# EasyEDA schematic SCH_MinijetengineECU_20260723.json

## Sheets
1 ECU_JET
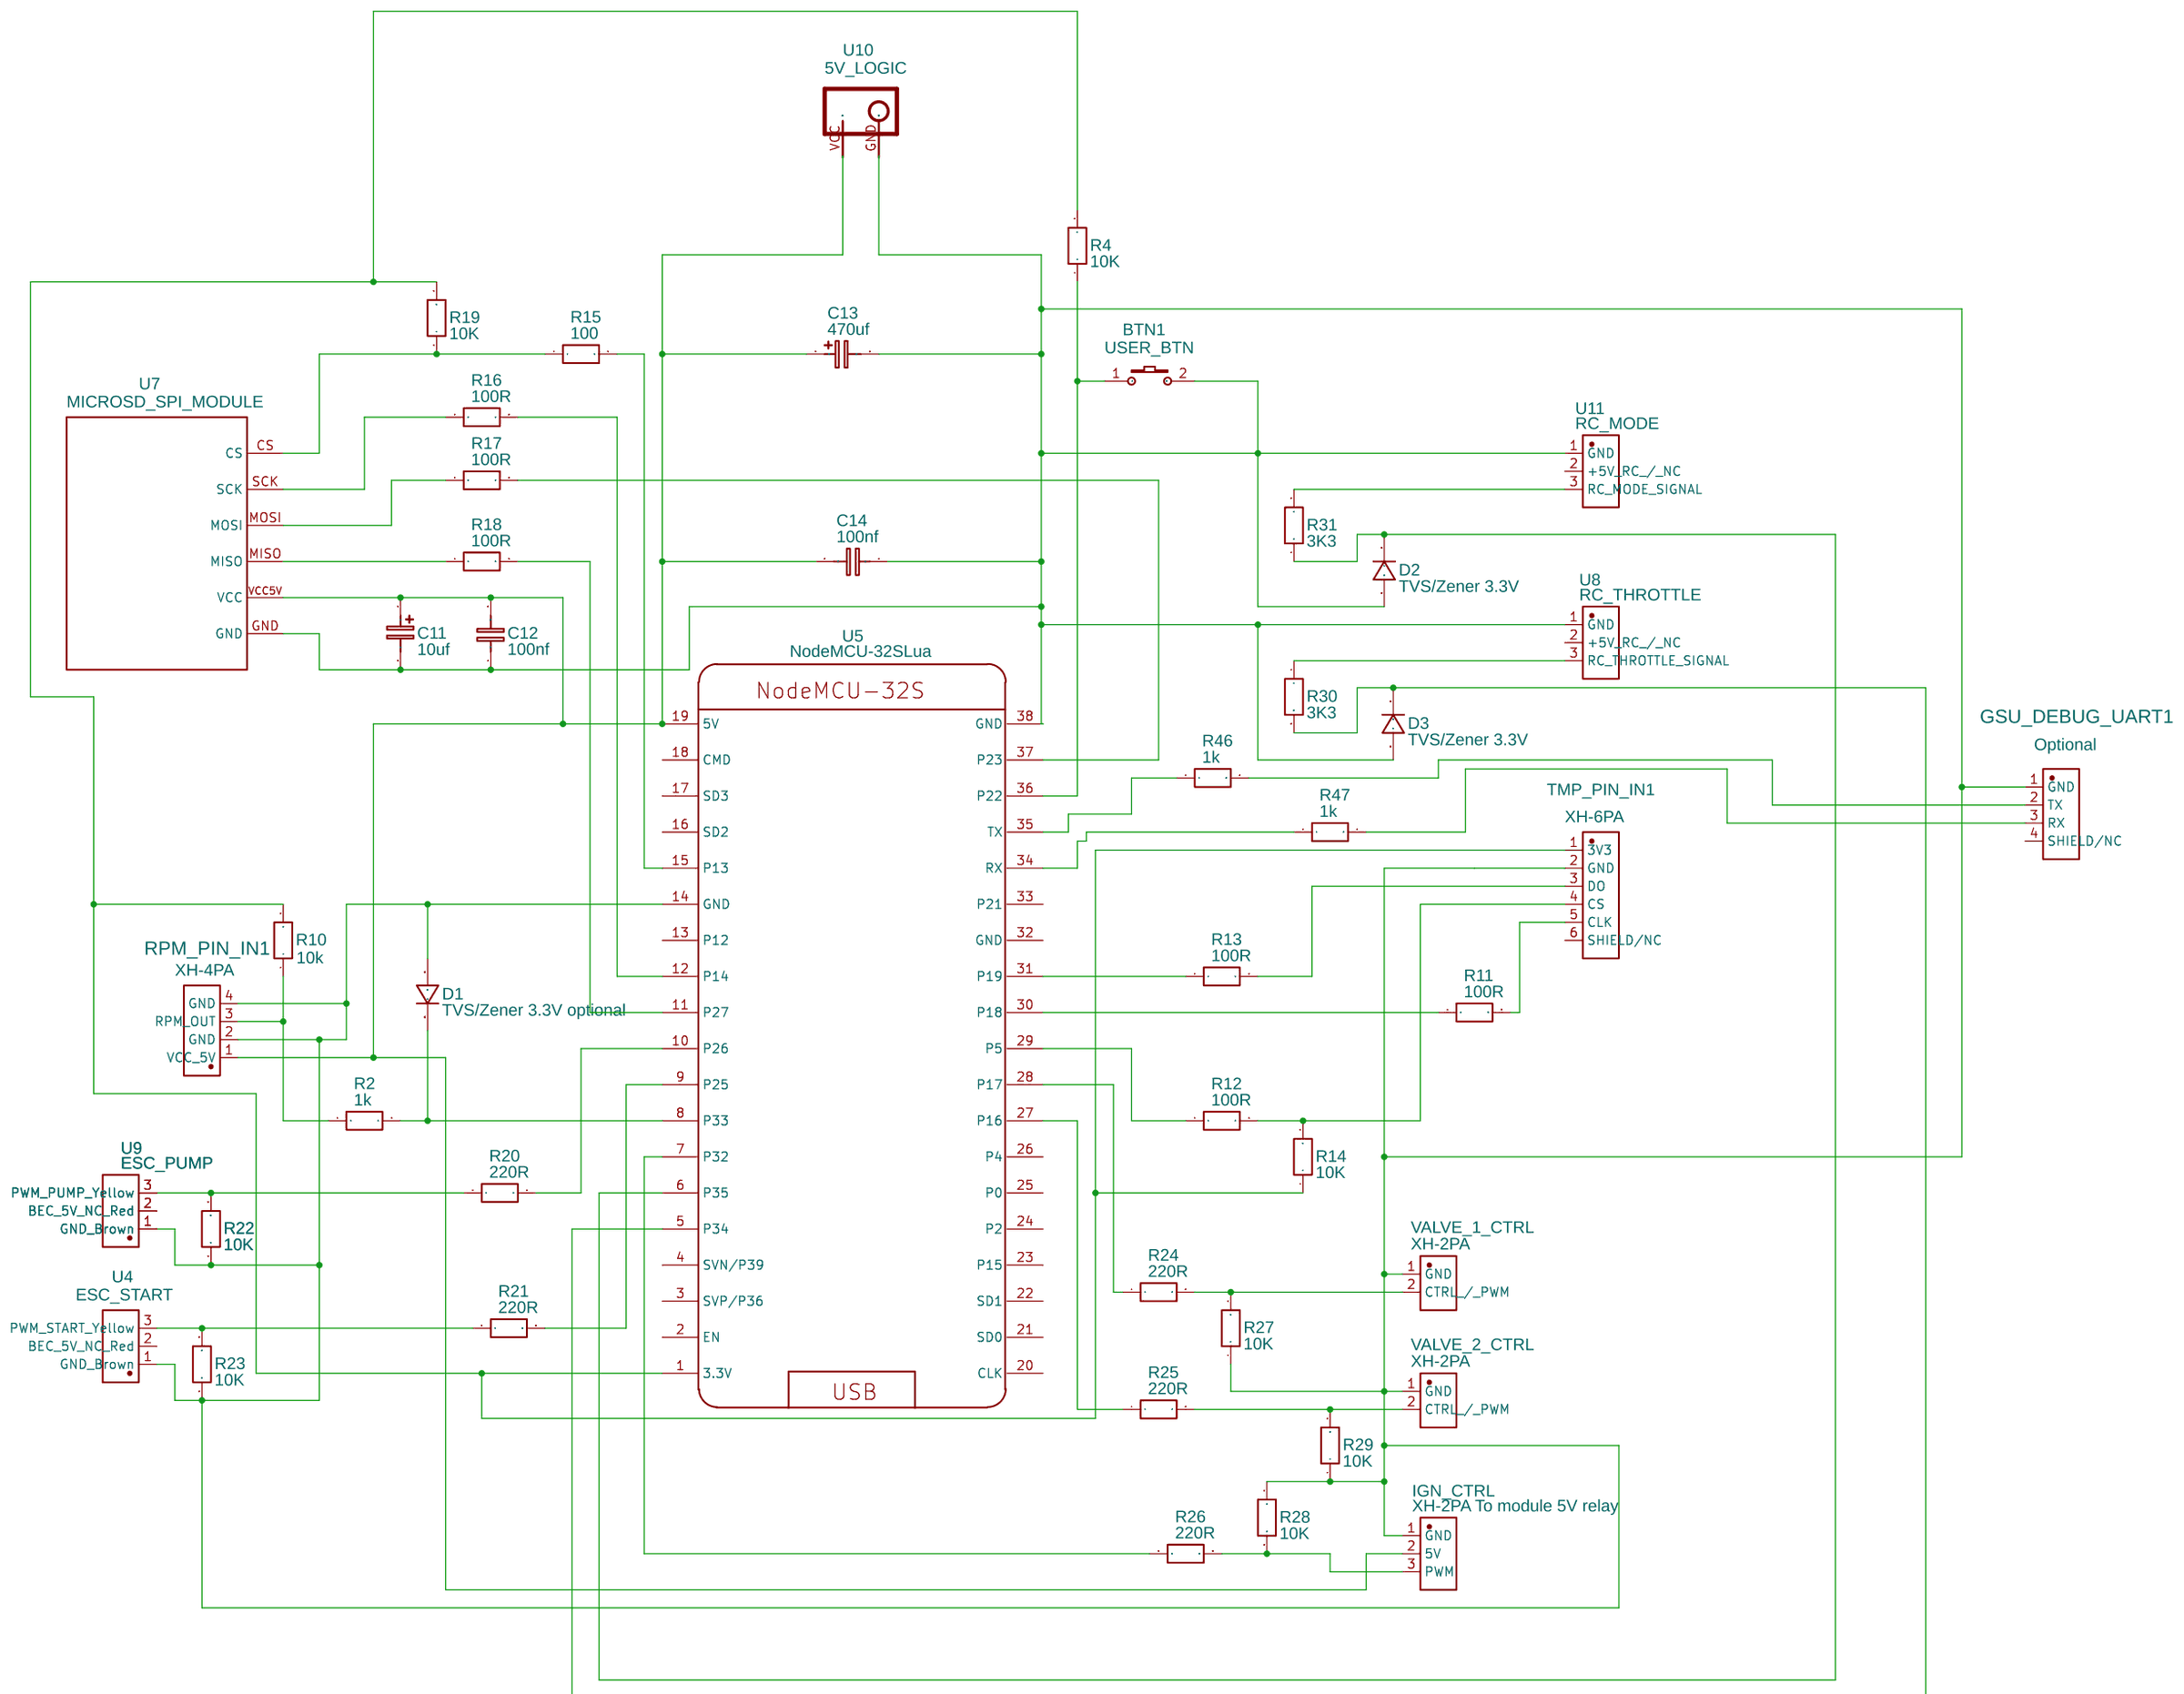
[diagram p0: ECU_JET]
2 RPM_Sensor
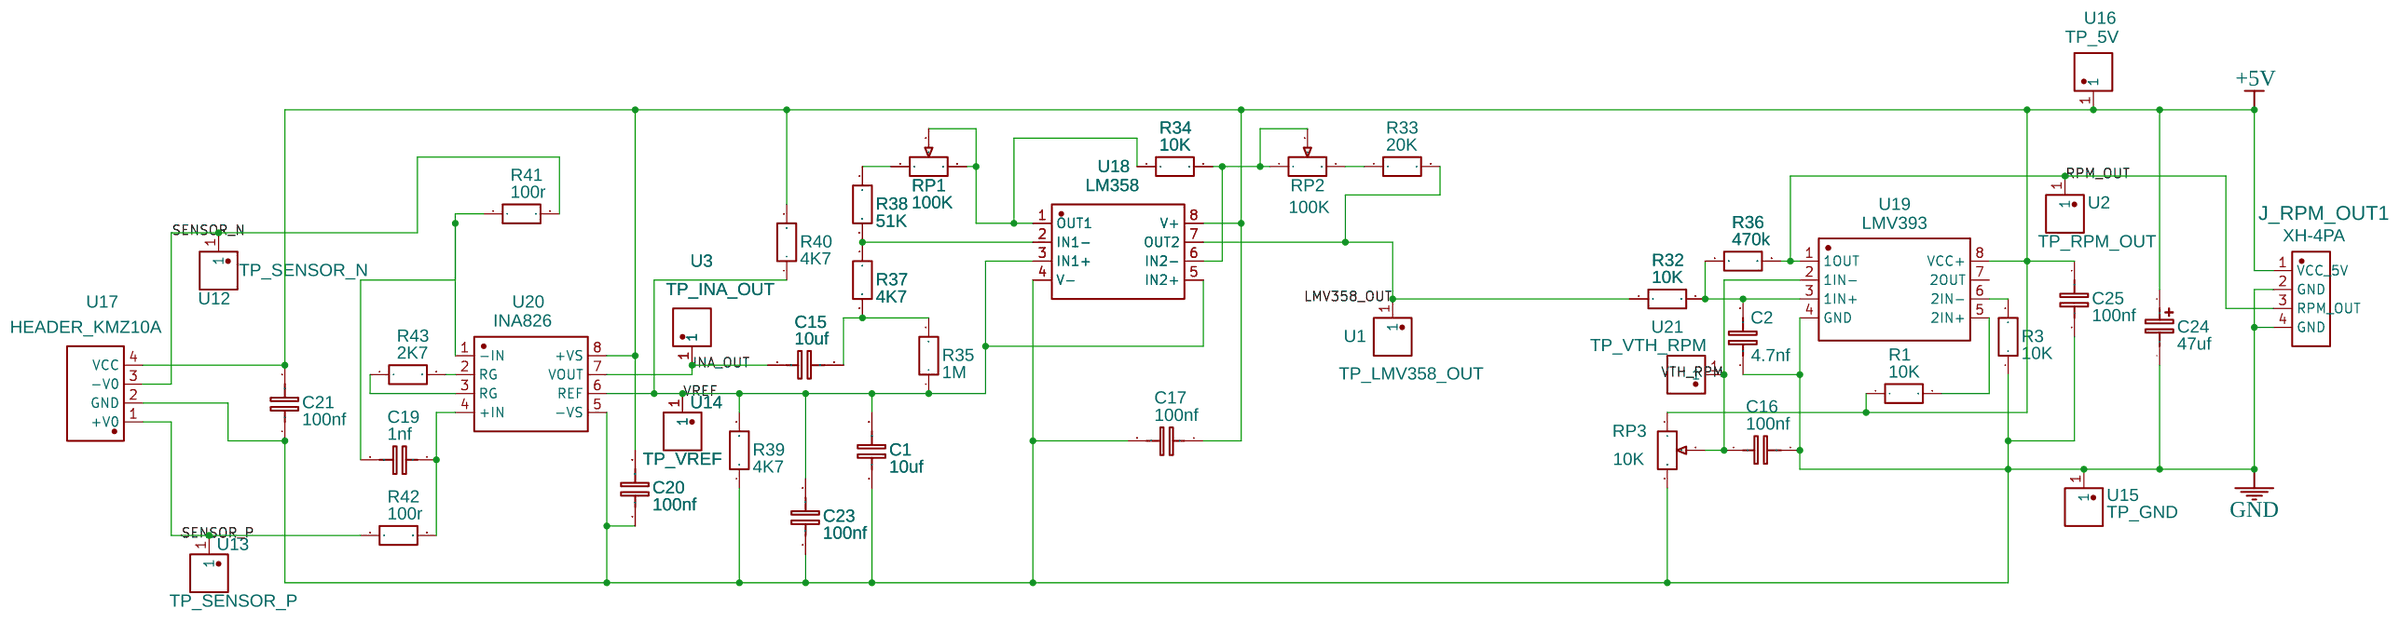
[diagram p1: RPM_Sensor]
3 Temperature_Sensor: TITLE: Sheet_1; REV: 1.0; Date: 2026-06-28; Sheet: 1/1; Drawn By: phamthemy3008; Company: Your Company
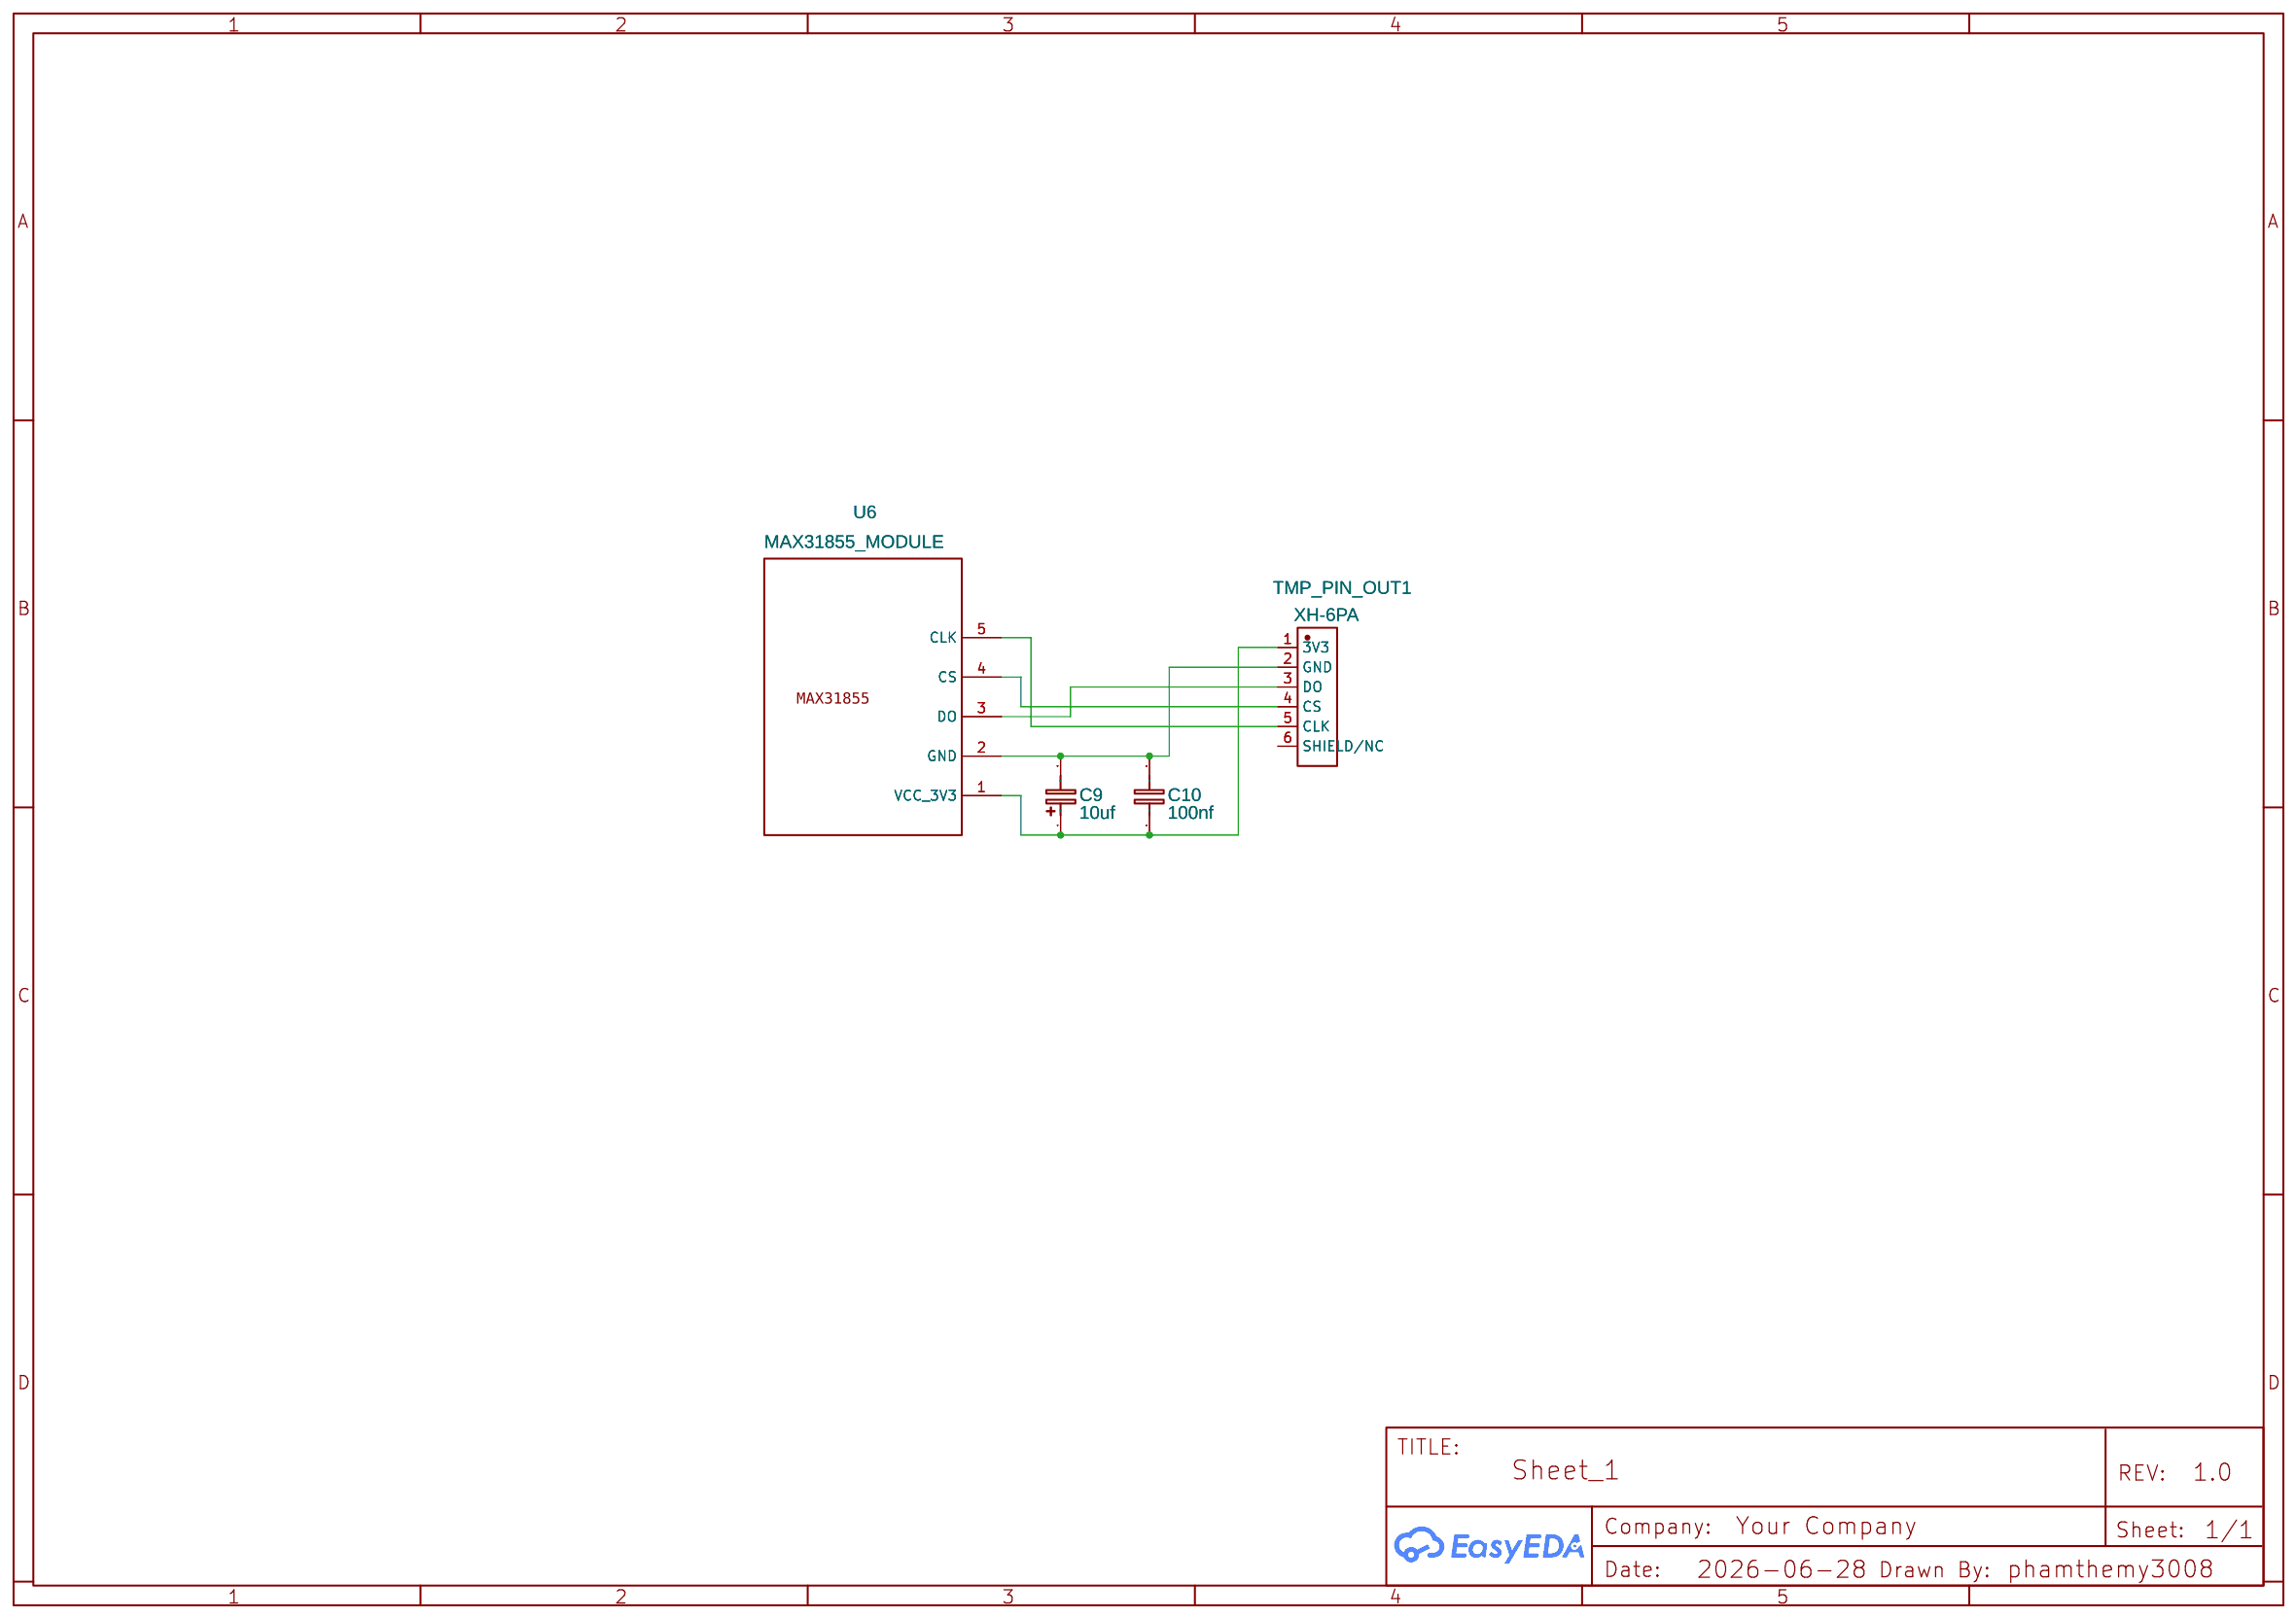
[diagram p2: Temperature_Sensor]

## Parts
sheet ECU_JET
BTN1  USER_BTN  [KEY-SMD_2P-L6.2-W3.6-LS8.0]
C11  10uf  [CAP-TH_BD6.3-P2.50-D0.5-FD_RC250M3R3LO6.3-11TH-2A1E]
C12  100nf  [CAP-TH_L4.0-W1.6-P2.54-D0.4]
C13  470uf  [CAP-TH_BD6.3-P2.50-D0.5-FD_RC250M3R3LO6.3-11TH-2A1E]
C14  100nf  [CAP-TH_L4.0-W1.6-P2.54-D0.4]
D1  TVS/Zener 3.3V optional  [DIODE-ZENER]
D2  TVS/Zener 3.3V  [DIODE-ZENER]
D3  TVS/Zener 3.3V  [DIODE-ZENER]
GSU_DEBUG_UART1  Optional  [CONN-TH_4P-P2.50_ZHOURI_XH-4PA]
IGN_CTRL  XH-2PA To module 5V relay  [CONN-TH_3P-P5.08_HEADER3-5.08-3P]
R2  1k  [RES-TH_L7.7-W3.1-P3.90-D0.6]
R4  10K  [RES-TH_L7.7-W3.1-P3.90-D0.6]
R10  10k  [RES-TH_L7.7-W3.1-P3.90-D0.6]
R11  100R  [RES-TH_L7.7-W3.1-P3.90-D0.6]
R12  100R  [RES-TH_L7.7-W3.1-P3.90-D0.6]
R13  100R  [RES-TH_L7.7-W3.1-P3.90-D0.6]
R14  10K  [RES-TH_L7.7-W3.1-P3.90-D0.6]
R15  100  [RES-TH_L7.7-W3.1-P3.90-D0.6]
R16  100R  [RES-TH_L7.7-W3.1-P3.90-D0.6]
R17  100R  [RES-TH_L7.7-W3.1-P3.90-D0.6]
R18  100R  [RES-TH_L7.7-W3.1-P3.90-D0.6]
R19  10K  [RES-TH_L7.7-W3.1-P3.90-D0.6]
R20  220R  [RES-TH_L7.7-W3.1-P3.90-D0.6]
R21  220R  [RES-TH_L7.7-W3.1-P3.90-D0.6]
R22  10K  [RES-TH_L7.7-W3.1-P3.90-D0.6]
R23  10K  [RES-TH_L7.7-W3.1-P3.90-D0.6]
R24  220R  [RES-TH_L7.7-W3.1-P3.90-D0.6]
R25  220R  [RES-TH_L7.7-W3.1-P3.90-D0.6]
R26  220R  [RES-TH_L7.7-W3.1-P3.90-D0.6]
R27  10K  [RES-TH_L7.7-W3.1-P3.90-D0.6]
R28  10K  [RES-TH_L7.7-W3.1-P3.90-D0.6]
R29  10K  [RES-TH_L7.7-W3.1-P3.90-D0.6]
R30  3K3  [RES-TH_L7.7-W3.1-P3.90-D0.6]
R31  3K3  [RES-TH_L7.7-W3.1-P3.90-D0.6]
R46  1k  [RES-TH_L7.7-W3.1-P3.90-D0.6]
R47  1k  [RES-TH_L7.7-W3.1-P3.90-D0.6]
RPM_PIN_IN1  XH-4PA  [CONN-TH_4P-P2.50_ZHOURI_XH-4PA]
TMP_PIN_IN1  XH-6PA  [CONN-TH_6P-P2.50_ZHOURI_XH-6PA]
U4  ESC_START  [CONN-TH_3P-P5.08_HEADER3-5.08-3P]
U5  NodeMCU-32SLua  [NODEMCU-32SLUA]
U7  MICROSD_SPI_MODULE  [CATALEX-MICROSD-CARD-DOWN]
U8  RC_THROTTLE  [CONN-TH_3P-P5.08_HEADER3-5.08-3P]
U9  ESC_PUMP  [CONN-TH_3P-P5.08_HEADER3-5.08-3P]
U10  5V_LOGIC  [DOMINO-2P-5.08]
U11  RC_MODE  [CONN-TH_3P-P5.08_HEADER3-5.08-3P]
VALVE_1_CTRL  XH-2PA  [CONN-TH_XH-2A]
VALVE_2_CTRL  XH-2PA  [CONN-TH_XH-2A]
sheet RPM_Sensor
C1  10uf  [C1210]
C2  4.7nf  [C0603]
C15  10uf  [C1210]
C16  100nf  [C0603]
C17  100nf  [C0603]
C19  1nf  [C0603]
C20  100nf  [C0603]
C21  100nf  [C0603]
C23  100nf  [C0603]
C24  47uf  [TAJC476K016RNJ_CAPMC6032X260]
C25  100nf  [C0603]
J_RPM_OUT1  XH-4PA  [CONN-TH_4P-P2.50_ZHOURI_XH-4PA]
R1  10K  [R0805]
R3  10K  [R0805]
R32  10K  [R0805]
R33  20K  [R0805]
R34  10K  [R0805]
R35  1M  [R0805]
R36  470k  [R0805]
R37  4K7  [R0805]
R38  51K  [R0805]
R39  4K7  [R0805]
R40  4K7  [R0805]
R41  100r  [R0805]
R42  100r  [R0805]
R43  2K7  [R0805]
RP1  100K  [RES-ADJ-TH_3296W-1-203]
RP2  100K  [RES-ADJ-TH_3296W-1-203]
RP3  10K  [RES-ADJ-TH_3296W-1-203]
U1  TP_LMV358_OUT  [TESTPOINT-SMD_PG-F13653-0103T]
U2  TP_RPM_OUT  [TESTPOINT-SMD_PG-F13653-0103T]
U3  TP_INA_OUT  [TESTPOINT-SMD_PG-F13653-0103T]
U12  TP_SENSOR_N  [TESTPOINT-SMD_PG-F13653-0103T]
U13  TP_SENSOR_P  [TESTPOINT-SMD_PG-F13653-0103T]
U14  TP_VREF  [TESTPOINT-SMD_PG-F13653-0103T]
U15  TP_GND  [TESTPOINT-SMD_PG-F13653-0103T]
U16  TP_5V  [TESTPOINT-SMD_PG-F13653-0103T]
U17  HEADER_KMZ10A  [HDR-TH_4P-P2.54-H-F-R2-C2-S2.54_PH2.54-1X4]
U18  LM358  [SOIC-8_L5.4-W4.4-P1.27-LS6.5-BL]
U19  LMV393  [SOIC-8_L5.4-W4.4-P1.27-LS6.5-BL]
U20  INA826  [SOIC-8_L4.9-W3.9-P1.27-LS6.0-BL]
U21  TP_VTH_RPM  [TESTPOINT-SMD_PG-F13653-0103T]
sheet Temperature_Sensor
C9  10uf  [CAP-TH_BD6.3-P2.50-D0.5-FD_RC250M3R3LO6.3-11TH-2A1E]
C10  100nf  [CAP-TH_L4.0-W1.6-P2.54-D0.4]
TMP_PIN_OUT1  XH-6PA  [CONN-TH_6P-P2.50_ZHOURI_XH-6PA]
U6  MAX31855_MODULE  [THERMOCOUPLE-MAX31855]

## Library data of the parts
BTN1 = K2-3.6×6.1_SMD: Supplier Part: C118141; Supplier: LCSC; Manufacturer Part: K2-1107ST-A4SW-06; Contributor: LCEDA_Lib; 制造商: 韩国韩荣
C9 C11 C13 = C_Tan_SMD_A_EU: Contributor: LCEDA_Lib
C1 C2 C10 C12 C14-C17 C19-C21 C23 C25 = C_0603_EU: Contributor: LCEDA_Lib
D1-D3 = 1N4007W: Contributor: LCEDA_Lib
GSU_DEBUG_UART1 J_RPM_OUT1 RPM_PIN_IN1 = XH-4PA: Contributor: lcsc; Supplier: LCSC; Supplier Part: C5258885; Manufacturer: ZHOURI(洲日); JLCPCB Part Class: Extended Part; Package Display: No
IGN_CTRL U4 U8 U9 U11 = HEADER35.08-3P: Contributor: lcsc; Supplier: LCSC; Supplier Part: C9900007547; Manufacturer: null; Manufacturer Part: Header35.08-3P; JLCPCB Part Class: Extended Part
R1-R4 R10-R43 R46 R47 = R_0603_EU: Contributor: LCEDA_Lib
TMP_PIN_IN1 TMP_PIN_OUT1 = XH-6PA: Contributor: lcsc; Supplier: LCSC; Supplier Part: C5258887; Manufacturer: ZHOURI(洲日); JLCPCB Part Class: Extended Part
U5 = NodeMCU-32SLua: Contributor: EasyEDA; Supplier: LCSC; Supplier Part: C111436; Manufacturer: Ai-Thinker
U7 = MICROSD_SPI_MODULE: Contributor: phamthemy3008
U10 = DOMINO-2P-5.08: Contributor: thuhoai06072000
VALVE_1_CTRL VALVE_2_CTRL = XH-2PA: Contributor: Tay Joo Chun; Supplier: LCSC; Supplier Part: C5258883; Manufacturer: ZHOURI(洲日); JLCPCB Part Class: Extended Part
C24 = C_Tan_SMD_A_EU: Contributor: LCEDA_Lib; Supplier Part: C22036; Supplier: LCSC; Manufacturer Part: TAJB476K010RNJ; Package Display: No; Manufacturer: Kyocera AVX
RP1 RP2 = R_3386P_EU: Supplier: LCSC; Contributor: LCEDA_Lib; Package Display: No
RP3 = R_3386P_EU: Supplier: LCSC; Contributor: LCEDA_Lib
U1-U3 U12-U16 U21 = YZP0352-20095-01: Supplier: LCSC; Supplier Part: C5157278; Manufacturer: Xinyangze(鑫扬泽); JLCPCB Part Class: Extended Part; Contributor: lcsc; Package Display: No
U17 = Magnetic Sensor: Contributor: ahmedsamy8720
U18 = LM358DGKRG: Supplier: LCSC; Supplier Part: C2923376; Manufacturer: TECH PUBLIC; Manufacturer Part: LMV358; Contributor: lcsc; Package Display: No
U19 = LMV393IDR: Supplier: LCSC; Manufacturer: TI(德州仪器); Supplier Part: C7984; JLCPCB Part Class: Extended Part
U20 = INA826AID: Contributor: LCSC; Supplier: LCSC; Supplier Part: C2868853; Manufacturer: TI(德州仪器); Package Display: No; JLCPCB Part Class: Extended Part
U6 = MAX31855_MODULE: Contributor: phamthemy3008

## Nets
+5V: C17.1 C20.2 C21.2 C24.+(1) C25.1(2) J_RPM_OUT1.1(VCC 5V) R1.1 R40.2 RP3.1 U16.1 U17.4(VCC) U18.8(V+) U19.8(VCC+) U20.8(+VS)
GND: C1.1 C2.1 C16.2 C17.2 C20.1 C21.1 C23.1 C24.-(2) C25.2(1) J_RPM_OUT1.2(GND) J_RPM_OUT1.4(GND) R3.1 R39.1 RP3.3 U15.1 U17.2(GND) U18.4(V-) U19.4(GND) U20.5(-VS)
INA_OUT: C15.1 U3.1 U20.7(VOUT)
LMV358_OUT: R32.1 R33.2 U1.1 U18.7(OUT2)
RPM_OUT: J_RPM_OUT1.3(RPM_OUT) R36.2 U2.1 U19.1(1OUT)
SENSOR_N: R41.2 U12.1 U17.3(-V0)
SENSOR_P: R42.1 U13.1 U17.1(+V0)
VREF: C1.2 C23.2 R35.1 R39.2 R40.1 U14.1 U18.3(IN1+) U18.5(IN2+) U20.6(REF)
VTH_RPM: C16.1 RP3.2 U19.2(1IN-) U21.1
Net-(BTN1-1): BTN1.1 R4.1 U5.36(P22)
Net-(BTN1-2): BTN1.2 C11.2 C12.1 C13.2 C14.1 D1.P$2(2) D2.P$2(2) D3.P$2(2) GSU_DEBUG_UART1.1(GND) IGN_CTRL.1(GND) R22.1 R23.1 R27.1 R28.1 R29.1 RPM_PIN_IN1.2(GND) RPM_PIN_IN1.4(GND) TMP_PIN_IN1.2(GND) U4.1(GND Brown) U5.14(GND) U5.38(GND) U7.GND U8.1(GND) U9.1(GND Brown) U10.GND U11.1(GND) VALVE_1_CTRL.1(GND) VALVE_2_CTRL.1(GND)
Net-(C2-2): C2.2 R32.2 R36.1 U19.3(1IN+)
Net-(C9-1): C9.1 C10.1 TMP_PIN_OUT1.1(3V3) U6.1(VCC_3V3)
Net-(C9-2): C9.2 C10.2 TMP_PIN_OUT1.2(GND) U6.2(GND)
Net-(C11-1): C11.1 C12.2 C13.1 C14.2 IGN_CTRL.2(5V) RPM_PIN_IN1.1(VCC 5V) U5.19(5V) U7.VCC5V(VCC) U10.VCC
Net-(C15-2): C15.2 R35.2 R37.2
Net-(C19-1): C19.1 R42.2 U20.4(+IN)
Net-(C19-2): C19.2 R41.1 U20.1(-IN)
Net-(D1-P$1): D1.P$1(1) R2.2 U5.8(P33)
Net-(D2-P$1): D2.P$1(1) R31.1 U5.6(P35)
Net-(D3-P$1): D3.P$1(1) R30.2 U5.5(P34)
Net-(GSU_DEBUG_UART1-2): GSU_DEBUG_UART1.2(TX) R46.2
Net-(GSU_DEBUG_UART1-3): GSU_DEBUG_UART1.3(RX) R47.2
Net-(IGN_CTRL-3): IGN_CTRL.3(PWM) R26.2 R28.2
Net-(R1-2): R1.2 U19.5(2IN+)
Net-(R2-1): R2.1 R10.1 RPM_PIN_IN1.3(RPM_OUT)
Net-(R3-2): R3.2 U19.6(2IN-)
Net-(R4-2): R4.2 R10.2 R14.1 R19.2 TMP_PIN_IN1.1(3V3) U5.1(3.3V)
Net-(R11-1): R11.1 U5.30(P18)
Net-(R11-2): R11.2 TMP_PIN_IN1.5(CLK)
Net-(R12-1): R12.1 U5.29(P5)
Net-(R12-2): R12.2 R14.2 TMP_PIN_IN1.4(CS)
Net-(R13-1): R13.1 U5.31(P19)
Net-(R13-2): R13.2 TMP_PIN_IN1.3(DO)
Net-(R15-1): R15.1 R19.1 U7.CS
Net-(R15-2): R15.2 U5.15(P13)
Net-(R16-1): R16.1 U7.SCK
Net-(R16-2): R16.2 U5.12(P14)
Net-(R17-1): R17.1 U7.MOSI
Net-(R17-2): R17.2 U5.37(P23)
Net-(R18-1): R18.1 U7.MISO
Net-(R18-2): R18.2 U5.11(P27)
Net-(R20-1): R20.1 R22.2 U9.3(PWM_PUMP Yellow)
Net-(R20-2): R20.2 U5.10(P26)
Net-(R21-1): R21.1 R23.2 U4.3(PWM_START Yellow)
Net-(R21-2): R21.2 U5.9(P25)
Net-(R24-1): R24.1 U5.28(P17)
Net-(R24-2): R24.2 R27.2 VALVE_1_CTRL.2(CTRL / PWM)
Net-(R25-1): R25.1 U5.27(P16)
Net-(R25-2): R25.2 R29.2 VALVE_2_CTRL.2(CTRL / PWM)
Net-(R26-1): R26.1 U5.7(P32)
Net-(R30-1): R30.1 U8.3(RC_THROTTLE_SIGNAL)
Net-(R31-2): R31.2 U11.3(RC_MODE_SIGNAL)
Net-(R33-1): R33.1 RP2.3
Net-(R34-1): R34.1 RP1.2 RP1.3 U18.1(OUT1)
Net-(R34-2): R34.2 RP2.1 RP2.2 U18.6(IN2-)
Net-(R37-1): R37.1 R38.2 U18.2(IN1-)
Net-(R38-1): R38.1 RP1.1
Net-(R43-1): R43.1 U20.3(RG)
Net-(R43-2): R43.2 U20.2(RG)
Net-(R46-1): R46.1 U5.35(TX)
Net-(R47-1): R47.1 U5.34(RX)
Net-(TMP_PIN_OUT1-3): TMP_PIN_OUT1.3(DO) U6.3(DO)
Net-(TMP_PIN_OUT1-4): TMP_PIN_OUT1.4(CS) U6.4(CS)
Net-(TMP_PIN_OUT1-5): TMP_PIN_OUT1.5(CLK) U6.5(CLK)

Not connected (* = marked no-connect by the designer): GSU_DEBUG_UART1 4(SHIELD/NC); TMP_PIN_IN1 6(SHIELD/NC); TMP_PIN_OUT1 6(SHIELD/NC); U4 2(BEC_5V_NC Red); U5 2(EN) 3(SVP/P36) 4(SVN/P39) 13(P12) 16(SD2) 17(SD3) 18(CMD) 20(CLK) 21(SD0) 22(SD1) 23(P15) 24(P2) 25(P0) 26(P4) 32(GND) 33(P21); U8 2(+5V_RC / NC); U9 2(BEC_5V_NC Red); U11 2(+5V_RC / NC); U19 7(2OUT)
